# EAGLE design Avionicapart1 (EAGLE 9.6.2)
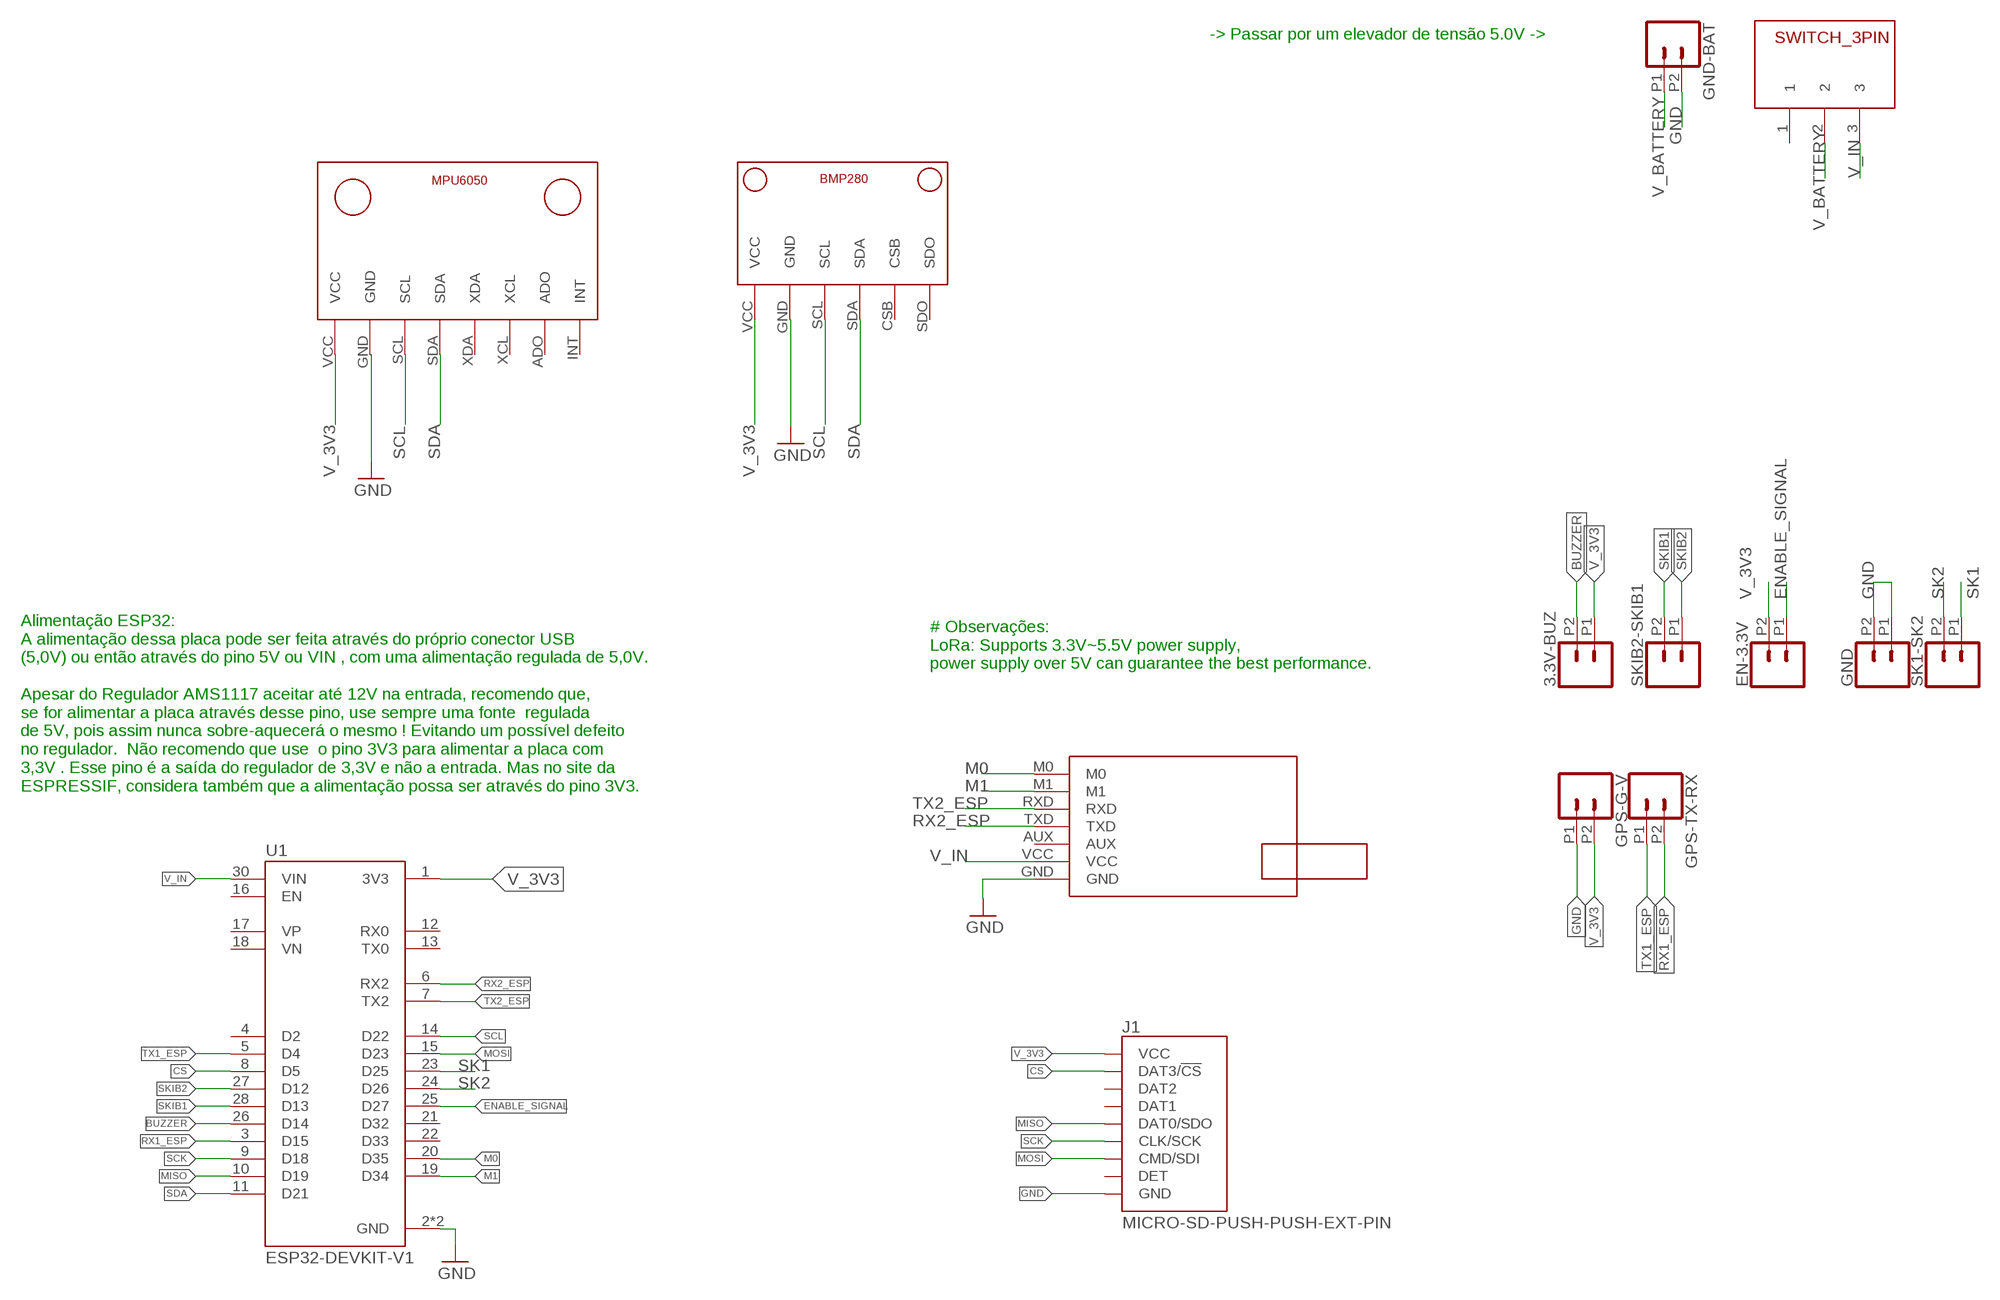
[diagram p0: schematic, sheet 1]

## Parts
3.3V-BUZ  CONN_022.54MM_SCREWTERM  [1X02_2.54_SCREWTERM]
EN-3.3V  CONN_022.54MM_SCREWTERM  [1X02_2.54_SCREWTERM]
GND  CONN_022.54MM_SCREWTERM  [1X02_2.54_SCREWTERM]
GND-BAT  CONN_022.54MM_SCREWTERM  [1X02_2.54_SCREWTERM]
GPS-G-V  CONN_022.54MM_SCREWTERM  [1X02_2.54_SCREWTERM]
GPS-TX-RX  CONN_022.54MM_SCREWTERM  [1X02_2.54_SCREWTERM]
J1  MICRO-SD-PUSH-PUSH-EXT-PIN  [MICROSD-EXTERNALPIN]
SK1-SK2  CONN_022.54MM_SCREWTERM  [1X02_2.54_SCREWTERM]
SKIB2-SKIB1  CONN_022.54MM_SCREWTERM  [1X02_2.54_SCREWTERM]
U1  ESP32-DEVKIT-V1  [MODULE_ESP32_DEVKIT_V1]
U$2  E22-400T30D  [E22-400T30D_FOOTPRINT]
U$4  BMP280V1  [BMP280_FOOTPRINT]
U$6  MPU6050V1  [MPU6050_FOOTPRINT]
U$11  SWITCH_3PIN  [SWITCH_3PIN]

## Nets
BUZZER: 3.3V-BUZ.P2 U1.26(D14)
CS: J1.2(DAT3/!CS!) U1.8(D5)
ENABLE_SIGNAL: EN-3.3V.P1 U1.25(D27)
GND: GND-BAT.P2 GND.P1 GND.P2 GPS-G-V.P1 J1.6(GND) J1.10(GND) J1.11(GND) J1.12(GND) J1.13(GND) U1.2(GND) U1.29(GND) U$2.GND U$4.GND U$6.GND
M0: U1.20(D35) U$2.M0
M1: U1.19(D34) U$2.M1
MISO: J1.7(DAT0/SDO) U1.10(D19)
MOSI: J1.3(CMD/SDI) U1.15(D23)
RX1_ESP: GPS-TX-RX.P2 U1.3(D15)
RX2_ESP: U1.6(RX2) U$2.TXD
SCK: J1.5(CLK/SCK) U1.9(D18)
SCL: U1.14(D22) U$4.SCL U$6.SCL
SDA: U1.11(D21) U$4.SDA U$6.SDA
SK1: SK1-SK2.P1 U1.23(D25)
SK2: SK1-SK2.P2 U1.24(D26)
SKIB1: SKIB2-SKIB1.P2 U1.28(D13)
SKIB2: SKIB2-SKIB1.P1 U1.27(D12)
TX1_ESP: GPS-TX-RX.P1 U1.5(D4)
TX2_ESP: U1.7(TX2) U$2.RXD
V_3V3: 3.3V-BUZ.P1 EN-3.3V.P2 GPS-G-V.P2 J1.4(VCC) U1.1(3V3) U$4.VCC U$6.VCC
V_BATTERY: GND-BAT.P1 U$11.2
V_IN: U1.30(VIN) U$2.VCC U$11.3
Unconnected: J1.1(DAT2) J1.8(DAT1) J1.9(DET) U1.4(D2) U1.12(RX0) U1.13(TX0) U1.16(EN) U1.17(VP) U1.18(VN) U1.21(D32) U1.22(D33) U$2.AUX U$4.CSB U$4.SDO U$6.ADO U$6.INT U$6.XCL U$6.XDA U$11.1

## Notes on the sheet
- -> Passar por um elevador de tensão 5.0V ->
- # Observações:
  LoRa: Supports 3.3V~5.5V power supply, 
  power supply over 5V can guarantee the best performance.
- Alimentação ESP32:
  A alimentação dessa placa pode ser feita através do próprio conector USB
  (5,0V) ou então através do pino 5V ou VIN , com uma alimentação regulada de 5,0V.
  
  Apesar do Regulador AMS1117 aceitar até 12V na entrada, recomendo que,
  se for alimentar a placa através desse pino, use sempre uma fonte  regulada
  de 5V, pois assim nunca sobre-aquecerá o mesmo ! Evitando um possível defeito
  no regulador.  Não recomendo que use  o pino 3V3 para alimentar a placa com
  3,3V . Esse pino é a saída do regulador de 3,3V e não a entrada. Mas no site da
  ESPRESSIF, considera também que a alimentação possa ser através do pino 3V3.

## Library data of the parts
3.3V-BUZ EN-3.3V GND GND-BAT GPS-G-V GPS-TX-RX SK1-SK2 SKIB2-SKIB1 = SparkFun-Connectors:CONN_02: Multi connection point. Often used as Generic Header-pin footprint for 0.1 inch spaced/style header connections On any of the 0.1 inch spaced packages, you can populate with these: Break Away Headers - Straight <https://www.sparkfun.com/products/116> (PRT-00116) Break Away Male Headers - Right Angle <https://www.sparkfun.com/products/553> (PRT-00553) Female Headers <https://www.sparkfun.com/products/115> (PRT-00115) Break Away Headers - Machine Pin <https://www.sparkfun.com/products/117> (PRT-00117) Break Away Female Headers - Swiss Machine Pin <https://www.sparkfun.com/products/743> (PRT-00743) For SCREWTERMINALS and SPRING TERMINALS visit here: Screw Terimnals on SparkFun.com <https://www.sparkfun.com/search/results?term=Screw+Terminals> (5mm/3.5mm/2.54mm spacing) This device is also useful as a general connection point to wire up your design to another part of your project. Our various solder wires solder well into these plated through hole pads. Hook-Up Wire - Assortment (Stranded, 22 AWG) <https://www.sparkfun.com/products/11375> (PRT-11375) Hook-Up Wire - Assortment (Solid Core, 22 AWG) <https://www.sparkfun.com/products/11367> (PRT-11367) View the entire wire category on our website here <https://www.sparkfun.com/categories/141> Special notes: Molex polarized connector foot print use with: PRT-08233 with associated crimp pins and housings. 2.54_SCREWTERM for use with PRT-10571. 3.5mm Screw Terminal footprints for PRT-08084 5mm Screw Terminal footprints for use with PRT-08432
J1 = SparkFun-Connectors:MICRO-SD: microSD Socket for Transflash Various sockets for µSD. tDoc lines correctly indicate media card edge positions when inserting (unlocked, locked, depressed). NOTE: CD1 and CD2 are connected internally, and the default detect state of the socket is detect pin to ground. SparkFun Products: WAV Trigger <https://www.sparkfun.com/products/13660> CAN-Bus Shield <https://www.sparkfun.com/products/13262> SparkFun Level Shifing microSD Breakout <https://www.sparkfun.com/products/13743>; PROD_ID: CONN-16110
U1 = ESP32-DEVKIT-V1:ESP32-DEVKIT-V1: Dual core, Wi-Fi: 2.4 GHz up to 150 Mbits/s,BLE (Bluetooth Low Energy) and legacy Bluetooth, 32 bits, Up to 240 MHz Check availability <https://pricing.snapeda.com/parts/ESP32-DEVKIT-V1/Do%20it/view-part?ref=eda>; AVAILABILITY: Not in stock; DESCRIPTION: Dual core, Wi-Fi: 2.4 GHz up to 150 Mbits/s,BLE (Bluetooth Low Energy) and legacy Bluetooth, 32 bits, Up to 240 MHz; MF: Do it; MP: ESP32-DEVKIT-V1; PACKAGE: None; PRICE: None
U$2 = CRD:E22-400T30D
U$4 = CRD:BMP280: Sensor barométrico
U$6 = CRD:MPU6050: Acelerômetro e Giroscópio
U$11 = CRD:SWITCH_3PIN

## Board
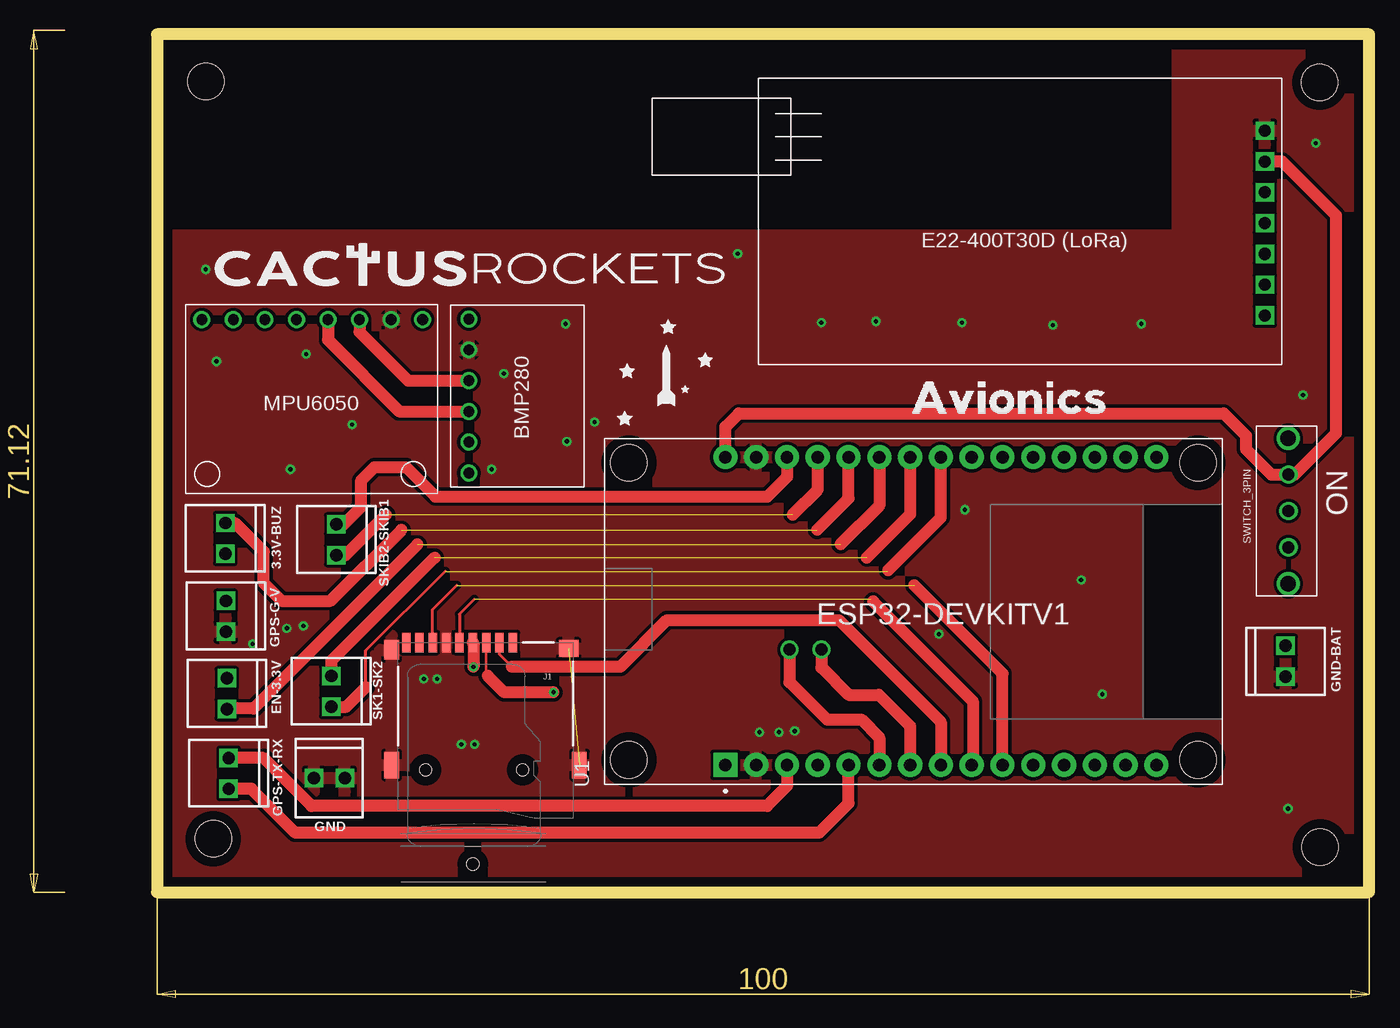
[diagram p1: board, top side]
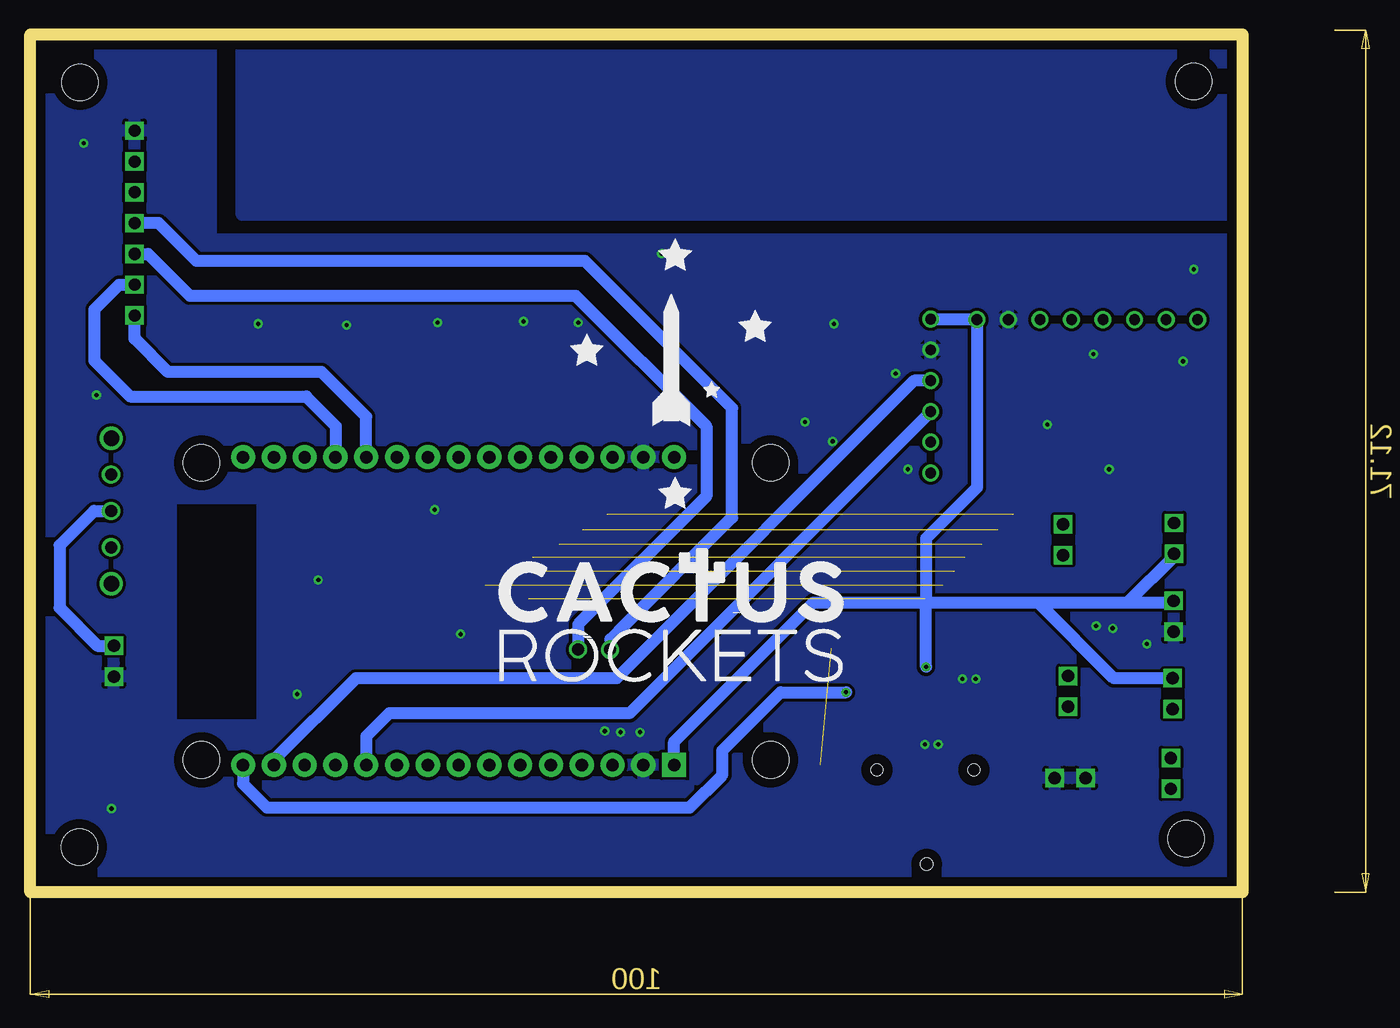
[diagram p2: board, bottom side, seen from below]

Size 100 x 70.79 mm. Coordinates in mm from the lower left corner, seen from the top.
Outline: 0,0 100,0 100,70.79 0,70.79 0,0
Copper layers (1*16): Top 0.035mm / dielectric 1.5mm / Bottom 0.035mm
Design rules "default *": minimum track width 0.15mm, minimum drill 0.35mm, track to track 10mil, track to pad 6mil, pad to pad 6mil, via to via 6mil, smd to smd 6mil, copper to edge 30mil, drill to drill 6mil, minimum pad ring 10mil, minimum via ring 8mil, stop-mask expansion 4mil, vias tented up to drill 1mm, thermal gap 10mil
Holes 3 mm at 4.04,66.91 4.64,4.41 95.96,3.74 95.9,66.82
Holes 1 mm at 26.05,2.33

### Footprints (pad centres in the part's own frame; a part is rotated, then mirrored left to right if it is on the bottom)
1X02_2.54_SCREWTERM = drill 1.016 square: P1 2.54,0; P2 0,0
MICROSD-EXTERNALPIN = smd 0.7 x 1.6: 1 2.25,10.5; 2 1.15,10.5; 3 0.05,10.5; 4 -1.05,10.5; 5 -2.15,10.5; 6 -3.25,10.5; 7 -4.35,10.5; 8 -5.45,10.5; 9 -6.55,10.5 | smd 1.2 x 1.6: 10 -7.75,9.9 | smd 1.2 x 2.2: 11 -7.75,0.4; 12 7.75,0.4 | smd 1.6 x 1.4: 13 6.85,10 | hole 1: 3.05,0; -4.95,0
MODULE_ESP32_DEVKIT_V1 = drill 1.02 pad 2 square: 1 -12.7,15.515 | drill 1.02 pad 2: 2 -12.7,12.975; 3 -12.7,10.435; 4 -12.7,7.895; 5 -12.7,5.355; 6 -12.7,2.815; 7 -12.7,0.275; 8 -12.7,-2.265; 9 -12.7,-4.805; 10 -12.7,-7.345; 11 -12.7,-9.885; 12 -12.7,-12.425; 13 -12.7,-14.965; 14 -12.7,-17.505; 15 -12.7,-20.045; 16 12.7,-20.045; 17 12.7,-17.505; 18 12.7,-14.965; 19 12.7,-12.425; 20 12.7,-9.885; 21 12.7,-7.345; 22 12.7,-4.805; 23 12.7,-2.265; 24 12.7,0.275; 25 12.7,2.815; 26 12.7,5.355; 27 12.7,7.895; 28 12.7,10.435; 29 12.7,12.975; 30 12.7,15.515 | hole 3: -12.28,-23.475; 12.23,-23.475; 12.23,23.475; -12.28,23.475
E22-400T30D_FOOTPRINT = drill 1 square: AUX -16.383,-0.762; GND -16.383,-5.842; M0 -16.383,9.398; M1 -16.383,6.858; RXD -16.383,4.318; TXD -16.383,1.778; VCC -16.383,-3.302
BMP280_FOOTPRINT = drill 0.891: CSB 3.686,-6.12; GND -3.934,-6.12; SCL -1.395,-6.12; SDA 1.145,-6.12; SDO 6.226,-6.12; VCC -6.474,-6.12
MPU6050_FOOTPRINT = drill 0.891: ADO 6.686,-10.184; GND -6.314,-10.184; INT 9.286,-10.184; SCL -3.715,-10.184; SDA -1.115,-10.184; VCC -8.915,-10.184; XCL 4.085,-10.184; XDA 1.486,-10.184
SWITCH_3PIN = drill 1: 1 -3,-0.018; 2 0,-0.018; 3 3,-0.018 | drill 1.27: P$1 -6,0; P$2 6,0

### Placement (x,y rotation side)
3.3V-BUZ  5.63,30.47 270 top
EN-3.3V  5.76,17.65 270 top
GND  12.94,9.42 0 top
GND-BAT  93.1,17.8 90 top
GPS-G-V  5.67,24.04 270 top
GPS-TX-RX  5.9,11.07 270 top
J1  27.1,10.1 0 top
SK1-SK2  14.37,17.85 270 top
SKIB2-SKIB1  14.79,30.36 270 top
U1  62.4,23.2 90 top
U$2  75.01,56.99 180 top
U$4  31.84,40.82 270 top
U$6  12.98,37.07 180 top
U$11  93.32,31.46 90 top

### Tracks (layer width: path | path; a pad name or v marks a point on that pad's centre or on a via)
ANTENNA
  pour Bottom: 0,69.85 0,55.88 82.55,55.88 82.55,69.85
BUZZER  (1 unrouted)
  Top 1: 54.45,29.9 57.04,32.49 U1.26 | 20.16,29.9 14.29,24.03 10.26,24.03 8.8,25.5 8.8,28.1 6.43,30.47 3.3V-BUZ.P2
CS
  Top 0.254: 29.28,18.61 28.25,19.64 J1.2
  Top 1: U1.8 64.66,14.04 56.24,22.46 42.08,22.46 38.23,18.61 29.28,18.61
ENABLE_SIGNAL  (1 unrouted)
  Top 1: U1.25 59.59,31.88 56.4,28.7 | 21.48,28.7 7.95,15.16 5.81,15.16 EN-3.3V.P1
GND  (via drill 0.35)  (1 unrouted)
  other vias: 4.9,43.8 12.3,44.4 16.1,38.6 11,34.9 4,51.4 33.7,46.9 47.9,52.7 36.1,38.8 27.6,34.9 28.6,42.8 33.8,37.2 22,17.6 23.1,17.6 25.1,12.2 26.2,12.2 49.7,13.2 51.3,13.2 52.6,13.3 64.5,21.3 66.65,31.56 76.24,25.76 77.99,16.35 93.3,6.9 94.54,41.03 95.6,61.8 81.2,46.9 73.9,46.8 66.4,47 59.3,47.1 54.8,47 10.7,21.78 12.06,21.96 7.89,20.49
  pour Bottom: 0,53.85 85.09,53.85 85.09,69.85 100.33,69.85 100.33,1.27 0,1.27
  pour Top: -0.1,54.2 84.2,54.2 84.2,69.7 99.9,69.7 99.9,0.2 -0.1,0.2
M0
  Bottom 1: U1.20 72.28,39.25 75.97,42.93 88.66,42.93 91.4,45.67 U$2.M0
M1
  Bottom 1: U1.19 74.8,35.92 74.8,38.46 77.24,40.9 91.76,40.9 94.7,43.84 94.7,48.1 92.67,50.13 U$2.M1
MISO  (1 unrouted)
  Top 0.254: J1.7 22.75,23.35 24.73,25.33
  Top 1: U1.10 69.75,18.05 62.46,25.33
MOSI  (via drill 0.35)
  Top 0.203: 27.28,17.86 27.15,17.98 J1.3
  Top 1: v32.7,16.5 28.63,16.5 27.28,17.86
  Bottom 1: U1.15 82.44,8.95 80.5,7 45.6,7 42.9,9.7 42.9,11.7 38.1,16.5 v32.7,16.5
RX1_ESP
  Top 1: U1.3 51.97,10.97 52,11 52,8.8 50.32,7.12 12.74,7.12 8.78,11.07 GPS-TX-RX.P2
RX2_ESP  (via drill 1)
  Top 1: v52.17,20.02 52.17,17.34 55.26,14.24 58.09,14.24 59.59,12.75 U1.6
  Bottom 1: 51.4,21.61 42.1,30.91 42.1,39.95 54.24,52.09 86.29,52.09 89.41,55.21 U$2.TXD | 52.14,20.86 52.14,20.02 v52.17,20.02
  Bottom 1.016: 51.4,21.61 52.14,20.86
SCK  (1 unrouted)
  Top 0.254: 58.88,24.18 59.06,24 | J1.5 24.95,22.95 26.18,24.18
  Top 1: 59.06,24 67.3,15.76 67.3,10.59 U1.9
SCL
  Top 1: U$6.SCL 16.69,46.23 20.71,42.22 U$4.SCL
  Bottom 1: U$4.SCL 27.08,42.22 51.63,17.66 73.14,17.66 79.91,10.9 U1.14
SDA
  Top 1: U$6.SDA 14.09,45.56 19.98,39.67 U$4.SDA
  Bottom 1: U$4.SDA 25.72,39.62 50.58,14.76 70.39,14.76 72.28,12.87 U1.11
SK1  (1 unrouted)
  Top 0.254: 23.77,26.48 17.22,19.94 17.22,16.91 | 60.24,26.48 60.31,26.56
  Top 1: SK1-SK2.P1 15.61,15.31 17.22,16.91 | U1.23 64.66,30.91 60.31,26.56
SK2  (1 unrouted)
  Top 1: U1.24 62.12,31.19 58.55,27.61 | 22.9,27.61 14.37,19.08 SK1-SK2.P2
SKIB1
  Top 1: U1.28 52,35.87 52,34.3 50.35,32.65 22.96,32.65 20.54,35.08 17.93,35.08 16.85,33.99 16.85,31.8 15.4,30.36 SKIB2-SKIB1.P2
SKIB2  (1 unrouted)
  Top 1: 52.43,31.16 54.5,33.23 U1.27 | 18.89,31.16 15.55,27.82 SKIB2-SKIB1.P1
TX1_ESP
  Top 1: U1.5 57.04,7.34 54.62,4.92 11.39,4.92 7.78,8.53 GPS-TX-RX.P1
TX2_ESP  (via drill 1)
  Top 1: v54.81,20.03 54.81,18.53 57.04,16.3 59.54,16.3 62.12,13.71 U1.7
  Bottom 1: U$2.RXD 90.28,52.67 86.83,49.22 55,49.22 44.23,38.45 44.23,32.66 54.81,22.08 v54.81,20.03
V_3V3  (via drill 0.35)
  Top 1: J1.4 26.1,20.55 v26.1,18.6
  Bottom 1: 26.1,23.9 35.4,23.9 46.88,12.41 U1.1 | 26.1,23.9 16.84,23.9 | 16.84,23.9 9.44,23.9 | U$4.VCC 25.68,47.25 U$6.VCC 21.9,33.4 26.1,29.2 26.1,23.9 | v26.1,18.6 26.1,23.9 | GPS-G-V.P2 5.81,23.9 9.44,23.9 | 3.3V-BUZ.P1 5.63,27.71 9.44,23.9 | EN-3.3V.P2 10.59,17.65 16.84,23.9
V_BATTERY
  Bottom 1: U$11.2 94.74,31.46 97.59,28.61 97.59,23.46 94.46,20.34 GND-BAT.P1
V_IN
  Top 1: U1.30 46.88,38.38 48,39.5 88,39.5 89.84,37.66 89.84,36.56 91.94,34.46 U$11.3 93.86,34.46 97.27,37.87 97.27,55.83 92.81,60.29 U$2.VCC

### Text on the board
tPlace: ESP32-DEVKITV1
tNames: ON